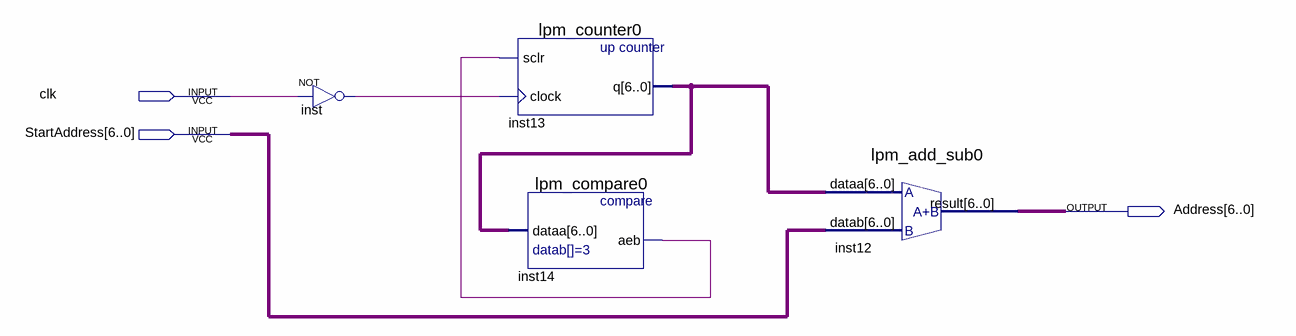
[diagram p0: schematic sheet]
// Quartus schematic FormAddress.bdf as structural Verilog: 4 symbols, 3 pins
module FormAddress (
  input  clk,
  input  [6:0] StartAddress,
  output [6:0] Address
);

  wire inst14_aeb, inst_out;
  wire [6:0] inst13_q;

  not inst (inst_out, clk);
  lpm_counter0 inst13 (.sclr(inst14_aeb), .clock(inst_out), .q(inst13_q));
  lpm_compare0 inst14 (.dataa(inst13_q), .aeb(inst14_aeb));
  lpm_add_sub0 inst12 (.dataa(inst13_q), .datab(StartAddress), .result(Address));
endmodule
